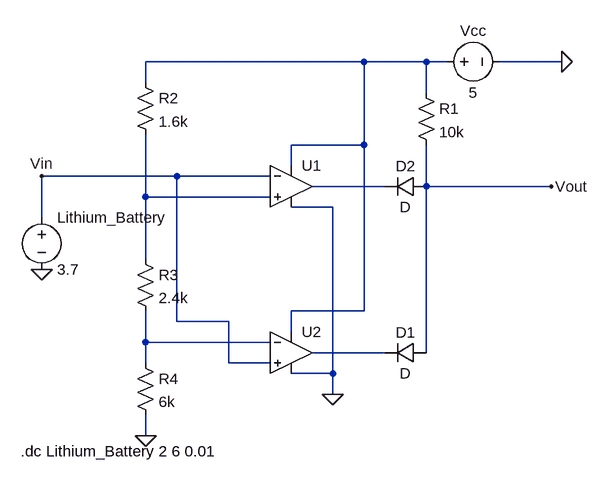
[diagram p0: schematic EV_BMS_Cell_Protection_Simulation.asc]
EV_BMS_Cell_Protection_Simulation.asc, the LTspice schematic file:
Version 4.1
SHEET 1 880 680
WIRE 304 -256 -32 -256
WIRE 400 -256 304 -256
WIRE 432 -256 400 -256
WIRE 608 -256 512 -256
WIRE -32 -224 -32 -256
WIRE 400 -208 400 -256
WIRE 304 -128 304 -256
WIRE 304 -128 192 -128
WIRE 192 -96 192 -128
WIRE 16 -80 -192 -80
WIRE 160 -80 16 -80
WIRE 336 -64 224 -64
WIRE 400 -64 400 -128
WIRE 592 -64 400 -64
WIRE -32 -48 -32 -144
WIRE 160 -48 -32 -48
WIRE 256 -32 192 -32
WIRE -192 -16 -192 -80
WIRE -32 48 -32 -48
WIRE 304 128 304 -128
WIRE 304 128 192 128
WIRE 16 144 16 -80
WIRE 96 144 16 144
WIRE 192 160 192 128
WIRE -32 176 -32 128
WIRE 160 176 -32 176
WIRE 336 192 224 192
WIRE 400 192 400 -64
WIRE -32 208 -32 176
WIRE 96 208 96 144
WIRE 160 208 96 208
WIRE 256 224 256 -32
WIRE 256 224 192 224
WIRE 256 256 256 224
WIRE -32 320 -32 288
FLAG 608 -256 0
FLAG -192 64 0
FLAG 256 256 0
FLAG -32 320 0
FLAG 592 -64 Vout
FLAG -192 -80 Vin
SYMBOL voltage 416 -256 R270
WINDOW 0 32 56 VTop 2
WINDOW 3 -32 56 VBottom 2
SYMATTR InstName Vcc
SYMATTR Value 5
SYMBOL res 384 -224 R0
SYMATTR InstName R1
SYMATTR Value 10k
SYMBOL voltage -192 -32 R0
SYMATTR InstName Lithium_Battery
SYMATTR Value 3.7
SYMBOL res -48 -240 R0
SYMATTR InstName R2
SYMATTR Value 1.6k
SYMBOL res -48 32 R0
SYMATTR InstName R3
SYMATTR Value 2.4k
SYMBOL res -48 192 R0
SYMATTR InstName R4
SYMATTR Value 6k
SYMBOL OpAmps\\UniversalOpAmp2 192 -64 R0
SYMATTR InstName U1
SYMBOL OpAmps\\UniversalOpAmp2 192 192 R0
SYMATTR InstName U2
SYMBOL diode 400 176 R90
WINDOW 0 0 32 VBottom 2
WINDOW 3 32 32 VTop 2
SYMATTR InstName D1
SYMBOL diode 400 -80 R90
WINDOW 0 0 32 VBottom 2
WINDOW 3 32 32 VTop 2
SYMATTR InstName D2
TEXT -224 344 Left 2 !.dc Lithium_Battery 2 6 0.01

The netlist it stands for:
* EV_BMS_Cell_Protection_Simulation.asc
Vcc N001 0 5
R1 N001 Vout 10k
V§Lithium_Battery Vin 0 3.7
R2 N001 N003 1.6k
R3 N003 N004 2.4k
R4 N004 0 6k
X§U1 N003 Vin N001 0 N002 level2 Avol=1Meg GBW=10Meg Slew=10Meg Ilimit=25m Rail=0 Vos=0 En=0 Enk=0 In=0 Ink=0 Rin=500Meg  ; pins In+ In- V+ V- OUT
X§U2 Vin N004 N001 0 N005 level2 Avol=1Meg GBW=10Meg Slew=10Meg Ilimit=25m Rail=0 Vos=0 En=0 Enk=0 In=0 Ink=0 Rin=500Meg  ; pins In+ In- V+ V- OUT
D1 Vout N005 D
D2 Vout N002 D
.model D D
.lib standard.dio
.dc Lithium_Battery 2 6 0.01
.lib UniversalOpAmp2.lib
.backanno
.end